# Altium schematic sheet _sensors_and_IOs.SchDoc: Sensors and I/Os
size A3; CompanyName: Nordic Semiconductor ASA; DrawnBy: EISK; Address1: Otto Nielsens veg 12; Address2: 7052 Trondheim; Address3: NORWAY; Revision: 1; SheetNumber: 4; SheetTotal: 4; DesignStatus: Prototype; Version: 0.1.2
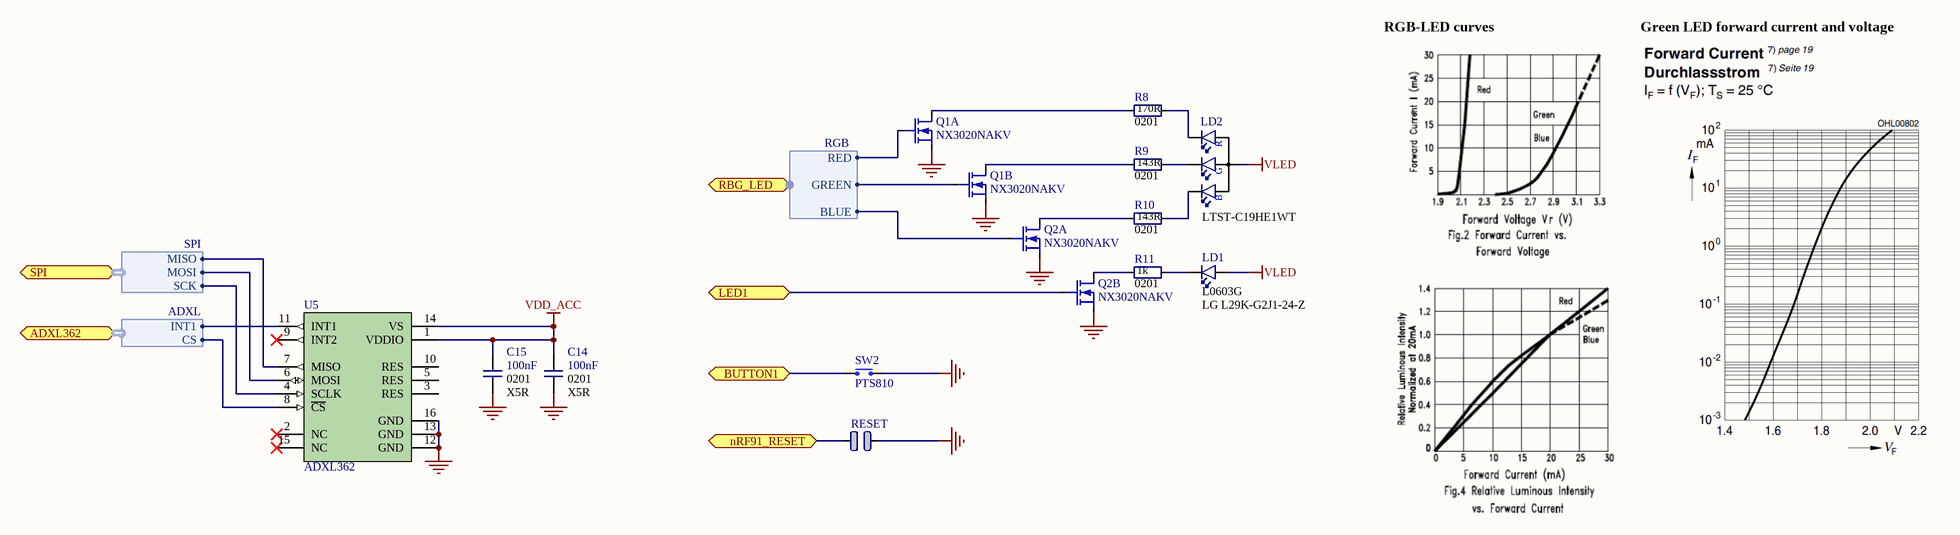
[diagram p0: _sensors_and_IOs.SchDoc]

## Parts
C14  100nF  Footprint Doc: 0201  TempCoeff: X5R  [CAPC0603X03L_C]
C15  100nF  Footprint Doc: 0201  TempCoeff: X5R  [CAPC0603X03L_C]
LD1  L0603G  Manufacturer Part Number: LG L29K-G2J1-24-Z  [LED_0603_G]
LD2  Part Number: LTST-C19HE1WT  [LED_RGB_0606]  (hidden comment: LED RGB)
Q1  NX3020NAKV  [NX3020NAKV]  (parts A,B of 2)
Q2  NX3020NAKV  [NX3020NAKV]  (parts A,B of 2)
R8  170R  Footprint Doc: 0201  [RESC0603X03L_C]
R9  143R  Footprint Doc: 0201  [RESC0603X03L_C]
R10  143R  Footprint Doc: 0201  [RESC0603X03L_C]
R11  1k  Footprint Doc: 0201  [RESC0603X03L_C]
RESET  Solderbridge  [Solderbridge]  (value not drawn)  (no BOM)
SW2  PTS810  [BTN_PTS810]
U5  ADXL362  [LGA50P322X300X114-16N]

## Ports
ADXL362 (bidir, harness ADXL), BUTTON1 (bidir), LED1 (bidir), nRF91_RESET (bidir), RBG_LED (bidir, harness RGB), SPI (bidir, harness SPI)

## Harnesses
SPI: MISO, MOSI, SCK
ADXL: CS, INT1
RGB: RED, GREEN, BLUE

## Nets
GND: C14.2 C15.2 Q1.1(S1) Q1.4(S2) Q2.1(S1) Q2.4(S2) RESET.1 SW2.1 U5.12(GND) U5.13(GND) U5.16(GND)
VDD_ACC: C14.1 C15.1 U5.1(VDDIO) U5.14(VS)
VLED: LD1.2(A) LD2.4(A)
BUTTON1: SW2.2 ; port BUTTON1
LED1: Q2.5(G2) ; port LED1
nRF91_RESET: RESET.2 ; port nRF91_RESET
NetLD1_1: LD1.1(C) R11.2
NetLD2_1: LD2.1(C_RED) R8.2
NetLD2_2: LD2.2(C_GREEN) R9.2
NetLD2_3: LD2.3(C_BLUE) R10.2
NetQ1_2: Q1.2(G1) ; port RBG_LED.RED
NetQ1_3: Q1.3(D2) R9.1
NetQ1_5: Q1.5(G2) ; port RBG_LED.GREEN
NetQ1_6: Q1.6(D1) R8.1
NetQ2_2: Q2.2(G1) ; port RBG_LED.BLUE
NetQ2_3: Q2.3(D2) R11.1
NetQ2_6: Q2.6(D1) R10.1
NetU5_4: U5.4(SCLK) ; port SPI.SCK
NetU5_6: U5.6(MOSI) ; port SPI.MOSI
NetU5_7: U5.7(MISO) ; port SPI.MISO
NetU5_8: U5.8(~{CS}) ; port ADXL362.CS
NetU5_11: U5.11(INT1) ; port ADXL362.INT1

Not connected (* = marked no-connect by the designer): U5 2(NC)* 3(RES) 5(RES) 9(INT2)* 10(RES) 15(NC)*

## Notes on the sheet
- RGB-LED curves
- Green LED forward current and voltage
- Title:
- Version:
- Drawn by:
- Status:
- Size:
- Sheet
- A3
- of
- Date:
- File:
- (in symbol D:LED_RGB) R; G; B

## Library data of the parts
C14 C15 = CAP:0201: Capacitor, X5R, ±10%, 10V; Artikkelnr Noca: N.A.; Manufacturer: *; Manufacturer Part Number: *; LatestRevisionDate: 2014-11-13; Pin Count: 2; Publisher: Nordic Semiconductor; Published: 2014-11-13; Value: 100nF; Note: 10V; HelpURL: *; Supplier 1: *; Supplier Part Number 1: *; Supplier 2: *; Supplier Part Number 2: *
LD1 = D:LED: LED, Green, 0603, 570nm, Vf=1.7V, 2.24..5.6mcd, - 40 to +100°C; Part Number: LG L29K Smartled Green; Manufacturer: Osram; Part number IPS: N.A.; Note: 2.24..5.6 mcd, Vfmin=1.7V; Artikkelnr Noca: 13019147; Footprint Doc: 0603; LatestRevisionDate: 2017-08-21; Pin Count: 2; Publisher: Nordic Semiconductor; Published: 2014-10-28; Value: L0603G; ComponentLink1URL: *; ComponentLink1Description: Datasheet; ComponentLink2URL: *; ComponentLink2Description: Supplier link; HelpURL: http://www.osram-os.com/Graphics/XPic2/00077107_0.pdf; Supplier 1: Digi-Key; Supplier Part Number 1: 475-2709-1-ND; Supplier 2: Mouser; Supplier Part Number 2: 720-LGL29KG2J124Z
LD2 = D:LED_RGB: RGB LED 1.60 mm x 1.60 mm SMD; Manufacturer: Lite-On Inc; 2nd source part number: 859-LTST-C19HE1WT; Part number IPS: 00000007798; Artikkelnr Noca: N.A.; Manufacturer Part Number: LTST-C19HE1WT; Datasheet: http://optoelectronics.liteon.com/upload/download/DS22-2008-0044/S_110_LTST-C19HE1WT.pdf; LatestRevisionDate: 2016-09-23; Pin Count: 4; Publisher: Nordic Semiconductor; Published: 2016-09-23; Value: LED RGB; Note: *; Supplier: Digi-Key; Supplier part number: 160-2162-1-ND; 2nd source Supplier: Mouser; Footprint Doc: LED_RGB_0606; Artikkelnr Simpro: N.A.
Q1 Q2 = T:FET-N-DUAL: MOSFET 2N-CH 30V 0.2A SOT666; Manufacturer: Nexperia; Manufacturer Part Number: NX3020NAKV,115; Artikkelnr Noca: N.A.; Part Number: NX3020NAKV; ComponentLink1URL: https://assets.nexperia.com/documents/data-sheet/NX3020NAKV.pdf; ComponentLink1Description: Datasheet; ComponentLink2URL: *; ComponentLink2Description: Supplier link; HelpURL: *; Footprint Doc: SOT666; LatestRevisionDate: 2018-12-13; Pin Count: 6; Publisher: Nordic Semiconductor; Published: 2018-12-13; Value: NX3020NAKV; Note: *; Supplier 1: Mouser; Supplier Part Number 1: 771-NX3020NAKV115; Supplier 2: Digi-Key; Supplier Part Number 2: 1727-1287-1-ND; Part number IPS: N.A.
R8-R11 = RES:0201: Manufacturer: *; Manufacturer Part Number: *; Package: 0201; Publisher: Nordic Semiconductor; LatestRevisionDate: 2019-06-11
  R8: Value: 170R
  R9 R10: Value: 143R
  R11: Value: 1k
RESET = SOLDERBRIDGE: Note: Not in BOM; ComponentLink1URL: *; ComponentLink1Description: Datasheet; ComponentLink2URL: *; ComponentLink2Description: Supplier link; Footprint Doc: Solderbridge; Pin Count: 2; Publisher: Nordic Semiconductor; Published: 2019-07-17; Value: Solderbridge
SW2 = BUTTON: SWITCH TACTILE SPST-NO 0.05A 16V; Manufacturer Part Number: PTS810 SJM 250 SMTR LFS; Manufacturer: C&K; Note: NO; Value: PTS810; Supplier 1: Digi-Key; Supplier Part Number 1: CKN10502CT-ND; ComponentLink1Description: Datasheet; ComponentLink1URL: https://www.ckswitches.com/media/1476/pts810.pdf; ComponentLink2Description: Digi-Key; ComponentLink2URL: https://www.digikey.no/product-detail/en/c-k/PTS810-SJM-250-SMTR-LFS/CKN10502DKR-ND/4176674; HelpDoc: https://www.ckswitches.com/media/1476/pts810.pdf
U5 = ADXL362: Micropower, 3-Axis, ±2 g/±4 g/±8 g Digital Output MEMS Accelerometer; Manufacturer: Analog Devices; Part number IPS: 00000001799; Artikkelnr Noca: N.A.; Part Number: ADXL362; Manufacturer Part Number: ADXL362; ComponentLink1URL: http://www.analog.com/media/en/technical-documentation/data-sheets/ADXL362.pdf; ComponentLink1Description: Datasheet; HelpURL: https://www.analog.com/media/en/technical-documentation/data-sheets/ADXL362.pdf; Footprint Doc: LGA-16; LatestRevisionDate: 2019-01-11; Pin Count: 16; Publisher: Nordic Semiconductor; Published: 2019-01-11; Value: ADXL362; Note: *; Supplier 1: Digi-Key; Supplier Part Number 1: ADXL362BCCZ-RL7CT-ND; Supplier 2: Mouser; Supplier Part Number 2: 584-ADXL362BCCZ-R7